# EasyEDA schematic SCH_LED driver_2023-04-18.json
TITLE: LED_driver 12W; REV: 1.0; Date: 2023-04-17; Sheet: 1/1; Drawn By: Me; Company: Your Company
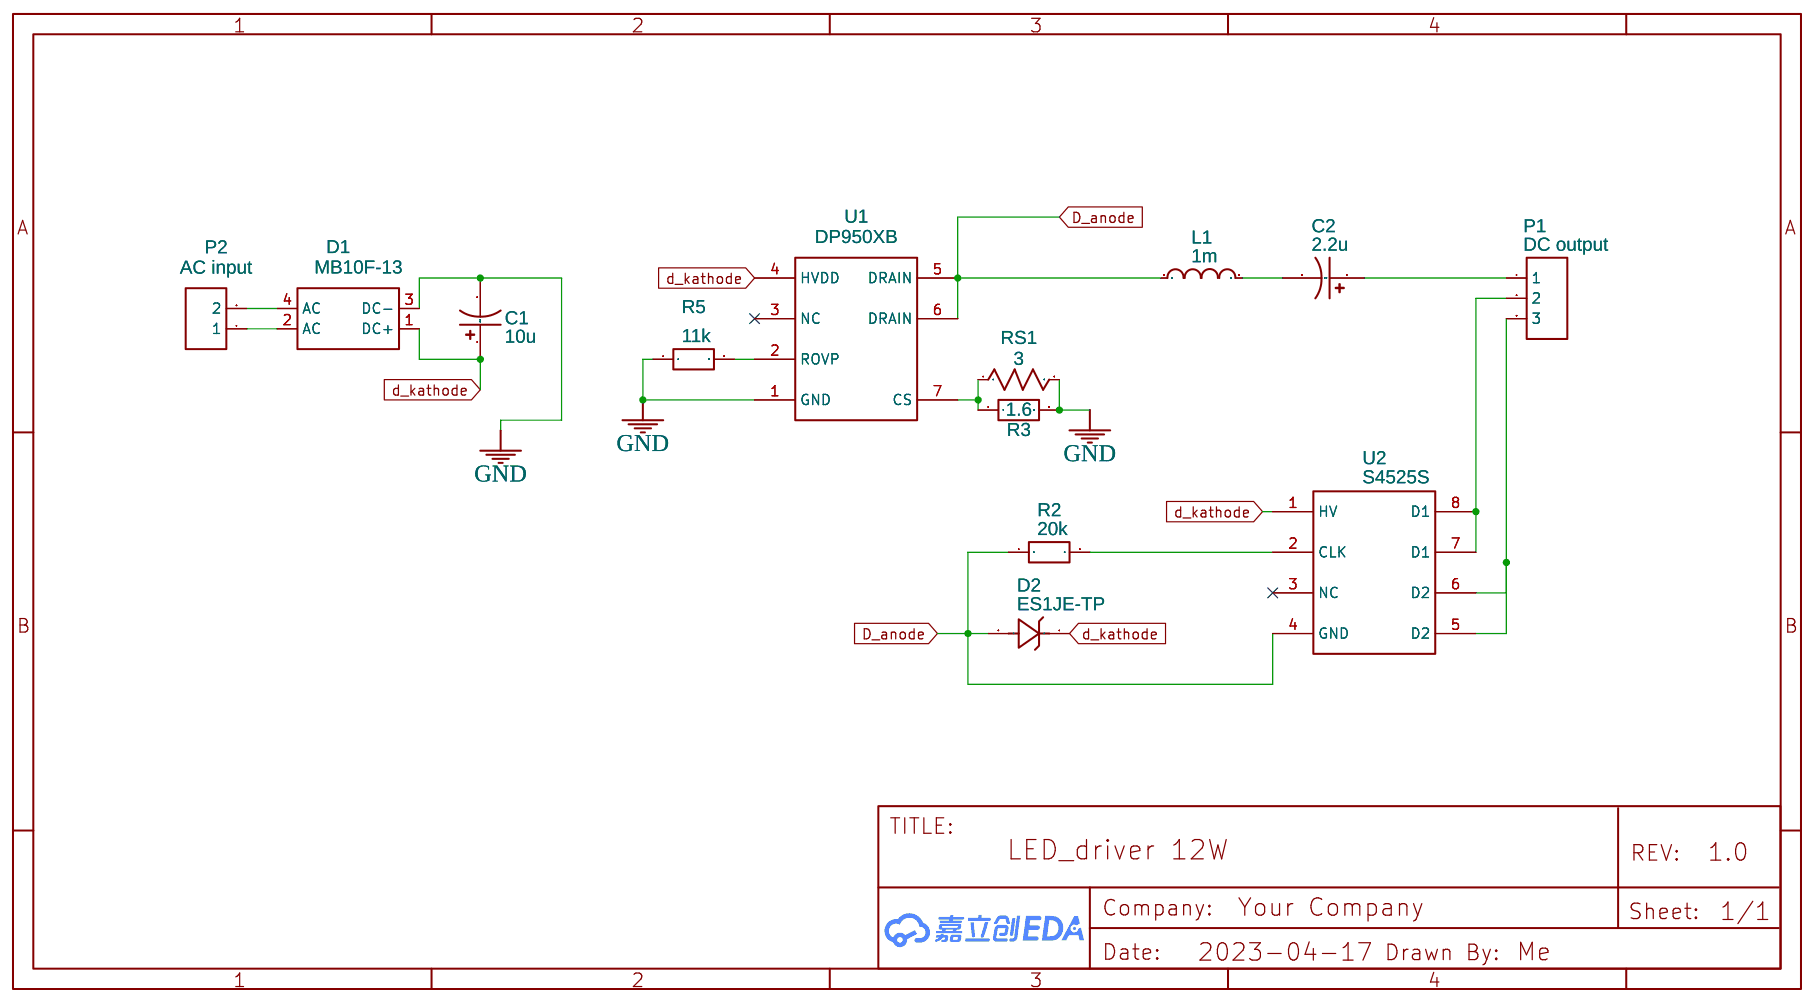
[diagram p0: schematic sheet]

## Parts
C1  10u  [CASE-A_3216]
C2  2.2u  [CASE-A_3216]
D1  MB10F-13  [MBF-SMD_L4.9-W4.1-P2.54-LS7.0-TR]
D2  ES1JE-TP  [SMA_L4.4-W2.8-LS5.4-RD]
L1  1m  [L0603]
P1  DC output  [CONN-TH_3P-P5.00]
P2  AC input  [CONN-TH_2P-P5.00]
R2  20k  [R0603]
R3  1.6  [R0603]
R5  11k  [R0603]
RS1  3  [R0603]
U1  DP950XB
U2  S4525S

## Library data of the parts
C1 C2 = C_Tan_SMD_A_US: Contributor: LCEDA_Lib
D1 = MB10F-13: Supplier: LCSC; Supplier Part: C780855; Manufacturer: DIODES(美台); Contributor: LCSC; JLCPCB Part Class: Extended Part
D2 = ES1JE-TP: Supplier: LCSC; Supplier Part: C779061; Manufacturer: MCC(美微科); Contributor: LCSC; JLCPCB Part Class: Extended Part
L1 = L0603_US: Contributor: LCEDA_Lib
P1 = CONN-TH_3P-P5.00: Supplier: LCSC; Contributor: LCEDA_Lib
P2 = CONN-TH_2P-P5.00: Supplier: LCSC; Contributor: LCEDA_Lib
R2 R3 R5 = R_0603_EU: Contributor: LCEDA_Lib
RS1 = R_0603_US: Contributor: LCEDA_Lib
U1 = DP950XB: Supplier: publicxin; link: http://en.publicxin.com/product/69.html; Contributor: lalmi.ahmed22
U2 = S4525S: Supplier: Shenzhen Xinfeiling Semiconductor; Supplier Part: S4525S L3C54BX NCMJ14X; Contributor: Lalmi Ahmed

## Nets
GND: C1.2 D1.3(DC-) R3.2 R5.1 RS1.2 U1.1(GND)
D_anode: D2.2(A) L1.1 R2.1 U1.5(DRAIN) U1.6(DRAIN) U2.4(GND)
d_kathode: C1.1 D1.1(DC+) D2.1(K) U1.4(HVDD) U2.1(HV)
Net-(C2-1): C2.1 P1.1
Net-(C2-2): C2.2 L1.2
Net-(D1-2): D1.2(AC) P2.1
Net-(D1-4): D1.4(AC) P2.2
Net-(P1-2): P1.2 U2.7(D1) U2.8(D1)
Net-(P1-3): P1.3 U2.5(D2) U2.6(D2)
Net-(R2-2): R2.2 U2.2(CLK)
Net-(R3-1): R3.1 RS1.1 U1.7(CS)
Net-(R5-2): R5.2 U1.2(ROVP)

Not connected (* = marked no-connect by the designer): U1 3(NC)*; U2 3(NC)*
